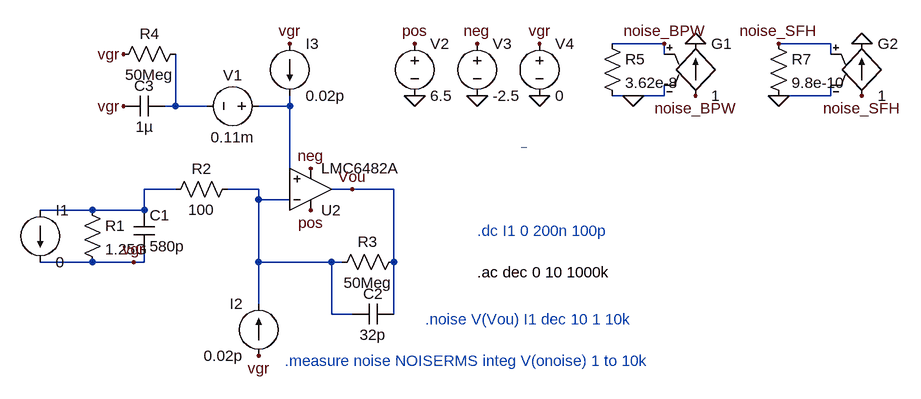
[diagram p0: schematic Draft1.asc]
Draft1.asc, the LTspice schematic file:
Version 4
SHEET 1 1380 680
WIRE 1008 48 928 48
WIRE 1264 48 1184 48
WIRE 1008 64 1008 48
WIRE 1264 64 1264 48
WIRE 960 128 928 128
WIRE 1008 128 1008 112
WIRE 1008 128 960 128
WIRE 1264 128 1264 112
WIRE 1264 128 1184 128
WIRE 256 144 256 64
WIRE 256 144 240 144
WIRE 304 144 256 144
WIRE 432 144 432 128
WIRE 432 144 384 144
WIRE 432 256 432 144
WIRE 256 272 208 272
WIRE 384 272 336 272
WIRE 528 272 496 272
WIRE 592 272 528 272
WIRE 384 288 384 272
WIRE 432 288 384 288
WIRE 128 304 48 304
WIRE 208 304 208 272
WIRE 208 304 128 304
WIRE 128 384 48 384
WIRE 192 384 128 384
WIRE 208 384 208 368
WIRE 208 384 192 384
WIRE 384 384 384 288
WIRE 496 384 384 384
WIRE 512 384 496 384
WIRE 592 384 592 272
WIRE 384 448 384 384
WIRE 496 464 496 384
WIRE 528 464 496 464
WIRE 592 464 592 384
FLAG 624 128 0
FLAG 720 128 0
FLAG 816 128 0
FLAG 624 48 pos
FLAG 464 304 pos
FLAG 816 48 vgr
FLAG 384 528 vgr
FLAG 192 384 vgr
FLAG 176 64 vgr
FLAG 176 144 vgr
FLAG 720 48 neg
FLAG 464 240 neg
FLAG 528 272 Vou
FLAG 1056 48 0
FLAG 1056 128 noise_BPW
FLAG 960 128 0
FLAG 1312 48 0
FLAG 1184 128 0
FLAG 1312 128 noise_SFH
FLAG 1184 48 noise_SFH
FLAG 1008 48 noise_BPW
FLAG 432 48 vgr
SYMBOL current 48 304 R0
SYMATTR InstName I1
SYMATTR Value 0
SYMATTR Value2 AC 1
SYMBOL res 112 288 R0
SYMATTR InstName R1
SYMATTR Value 1.25G
SYMBOL cap 192 304 R0
SYMATTR InstName C1
SYMATTR Value 580p
SYMBOL res 352 256 R90
WINDOW 0 0 56 VBottom 2
WINDOW 3 32 56 VTop 2
SYMATTR InstName R2
SYMATTR Value 100
SYMBOL res 608 368 R90
WINDOW 0 0 56 VBottom 2
WINDOW 3 32 56 VTop 2
SYMATTR InstName R3
SYMATTR Value 50Meg
SYMBOL res 272 48 R90
WINDOW 0 0 56 VBottom 2
WINDOW 3 32 56 VTop 2
SYMATTR InstName R4
SYMATTR Value 50Meg
SYMBOL cap 592 448 R90
WINDOW 0 0 32 VBottom 2
WINDOW 3 32 32 VTop 2
SYMATTR InstName C2
SYMATTR Value 32p
SYMBOL cap 240 128 R90
WINDOW 0 0 32 VBottom 2
WINDOW 3 32 32 VTop 2
SYMATTR InstName C3
SYMATTR Value 1µ
SYMBOL current 384 528 R180
WINDOW 0 24 80 Left 2
WINDOW 3 24 0 Left 2
SYMATTR InstName I2
SYMATTR Value 0.02p
SYMATTR Value2 AC 6p
SYMBOL voltage 400 144 R90
WINDOW 0 -32 56 VBottom 2
WINDOW 3 32 56 VTop 2
SYMATTR InstName V1
SYMATTR Value 0.11m
SYMATTR Value2 AC 3.7m
SYMBOL voltage 624 32 R0
SYMATTR InstName V2
SYMATTR Value 6.5
SYMBOL voltage 720 32 R0
SYMATTR InstName V3
SYMATTR Value -2.5
SYMBOL voltage 816 32 R0
SYMATTR InstName V4
SYMATTR Value 0
SYMBOL TI/LMC6482A 464 336 M180
SYMATTR InstName U2
SYMBOL g 1056 32 R0
SYMATTR InstName G1
SYMATTR Value 1
SYMBOL Res 912 32 R0
SYMATTR InstName R5
SYMATTR Value 3.62e-8
SYMBOL g 1312 32 R0
SYMATTR InstName G2
SYMATTR Value 1
SYMBOL Res 1168 32 R0
SYMATTR InstName R7
SYMATTR Value 9.8e-10
SYMBOL current 432 48 R0
SYMATTR InstName I3
SYMATTR Value 0.02p
TEXT 720 400 Left 2 !.ac dec 0 10 1000k
TEXT 720 336 Left 2 ;.dc I1 0 200n 100p
TEXT 640 472 Left 2 ;.noise V(Vou) I1 dec 10 1 10k
TEXT 424 536 Left 2 ;.measure noise NOISERMS integ V(onoise) 1 to 10k
LINE Normal 796 208 788 208 2

The netlist it stands for:
* Draft1.asc
I1 N003 vgr 0 AC 1
R1 N003 vgr 1.25G
C1 N003 vgr 580p
R2 N004 N003 100
R3 Vou N004 50Meg
R4 N001 vgr 50Meg
C2 Vou N004 32p
C3 N001 vgr 1µ
I2 vgr N004 0.02p AC 6p
V1 N002 N001 0.11m AC 3.7m
V2 pos 0 6.5
V3 neg 0 -2.5
V4 vgr 0 0
* U2: LMC6482A (symbol TI/LMC6482A not available, pins judged from their places): In+=N002 In-=N004 V+=pos V-=neg OUT=Vou
G1 noise_BPW 0 noise_BPW 0 1
R5 noise_BPW 0 3.62e-8
G2 noise_SFH 0 noise_SFH 0 1
R7 noise_SFH 0 9.8e-10
I3 vgr N002 0.02p
.ac dec 0 10 1000k
* .dc I1 0 200n 100p
* .noise V(Vou) I1 dec 10 1 10k
* .measure noise NOISERMS integ V(onoise) 1 to 10k
.backanno
.end